# Altium schematic sheet 40_INPUT_ROUTING.SchDoc
size A; SheetNumber: 5; SheetTotal: 8
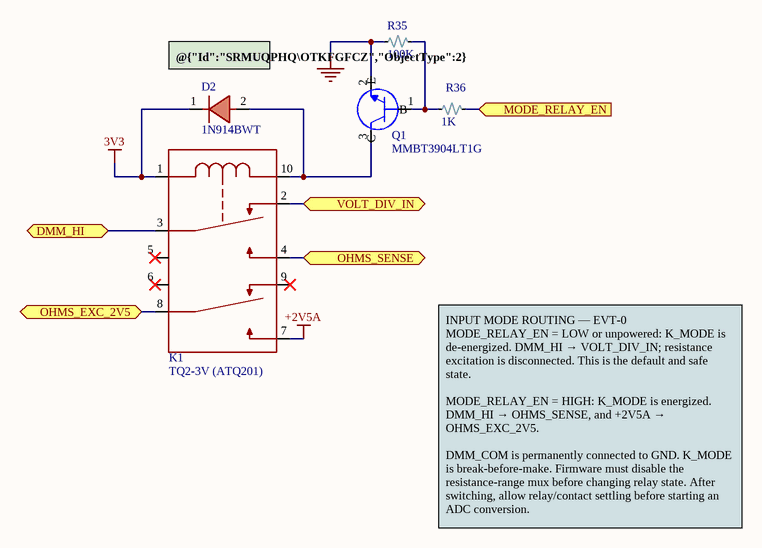
[diagram p0: 40_INPUT_ROUTING.SchDoc]

## Parts
D2  1N914BWT  [1N914BWT]
K1  TQ2-3V (ATQ201)  [TQ2-3V]
Q1  MMBT3904LT1G  [MMBT3904]
R35  100K  [R0805]
R36  1K  [R0805]

## Ports
DMM_HI (bidir, see 00_SYSTEM_TOP[4C], 70_MODULE_INTERFACE[1B]), MODE_RELAY_EN (in, see 00_SYSTEM_TOP[3B], 20_MCU_BLE[1C]), OHMS_EXC_2V5 (bidir, see 00_SYSTEM_TOP[4B], 60_RESISTANCE_FRONTEND[4B]), OHMS_SENSE (bidir, see 00_SYSTEM_TOP[3B], 60_RESISTANCE_FRONTEND[2B]), VOLT_DIV_IN (bidir, see 00_SYSTEM_TOP[3C], 50_VOLTAGE_FRONTEND[2B])

## Nets
3V3: D2.1(cathode) K1.1
+2V5A: K1.7
GND: Q1.2(E) R35.1
DMM_HI: K1.3 ; port DMM_HI
MODE_RELAY_EN: R36.2 ; port MODE_RELAY_EN
OHMS_EXC_2V5: K1.8 ; port OHMS_EXC_2V5
OHMS_SENSE: K1.4 ; port OHMS_SENSE
VOLT_DIV_IN: K1.2 ; port VOLT_DIV_IN
NetD2_2: D2.2(anode) K1.10 Q1.3(C)
NetQ1_1: Q1.1(B) R35.2 R36.1

Not connected (* = marked no-connect by the designer): K1 5* 6* 9*

## Notes on the sheet
- (near D2) @{"Id":"SRMUQPHQ\OTKFGFCZ","ObjectType":2} V/Ω Select
- INPUT MODE ROUTING — EVT-0
  MODE_RELAY_EN = LOW or unpowered: K_MODE is de-energized. DMM_HI → VOLT_DIV_IN; resistance excitation is disconnected. This is the default and safe state.
  MODE_RELAY_EN = HIGH: K_MODE is energized. DMM_HI → OHMS_SENSE, and +2V5A → OHMS_EXC_2V5.
  DMM_COM is permanently connected to GND. K_MODE is break-before-make. Firmware must disable the resistance-range mux before changing relay state. After switching, allow relay/contact settling before starting an ADC conversion.

## Library data of the parts
D2 = 1N914BWT: DIODE STANDARD 75V 200MA SOD523F; Manufacturer: onsemi; Manufacturer Lifecycle Status: ACTIVE; Value: 4pF; Element Configuration: Single; Forward Current: 300mA; Forward Voltage: 720mV; Max Junction Temperature (Tj): 150°C; Max Output current: 150mA; Max Power Dissipation: 200mW; Max Reverse Leakage Current: 5µA; Number of Elements: 1; Recovery Time: 4ns; Reverse Voltage: 100V; Supplier: DigiKey; Supplier Part Number: 1N914BWTCT-ND; Manufacturer Part Number: 1N914BWT; RoHS: Compliant; Category: Rectifier Diodes; Stock: 1541183; Pricing: 1=0.17, 10=0.102, 50=0.0726, 100=0.0629, 500=0.04556 (USD); Average Rectified Current: 200mA; China RoHS: Compliant; Contact Plating: Tin; Country of Origin: Mainland China; Export Control Classification Number (ECCN) Code: EAR99; Height: 700µm; Harmonized Tariff Schedule (HTS) Code: 8541.10.00.70; Introduction Date: 2008-03-18; Lead Free: Lead Free; Lifecycle Status: Production; Max Operating Temperature: 150°C; Max Repetitive Reverse Voltage (Vrrm): 75V; Max Reverse Voltage (DC): 75V; Min Operating Temperature: -55°C; Mounting Technology: Surface Mount; Pins: 2; Number of Terminals: 2; Peak Reverse Current: 5µA; Power Dissipation: 200mW; Radiation Hardening: No; REACH SVHC: Yes; Reverse Recovery Time: 4ns; Reverse Standoff Voltage: 75V; Schedule B: 8541100070, 8541100070|8541100070|8541100070|8541100070|8541100070; Weight: 10mg; ComponentLink1URL: https://datasheet.octopart.com:443/1N914BWT-ON-Semiconductor-datasheet-137236191.pdf?src-supplier=JRH+Electronics; ComponentLink1Description: https://datasheet.octopart.com:443/1N914BWT-ON-Semiconductor-datasheet-137236191.pdf?src-supplier=JRH+Electronics; ComponentLink2URL: https://sigma.octopart.com:443/138897313/technical_drawing/ON-Semiconductor-1N914BWT.pdf?src-supplier=Upverter; ComponentLink2Description: https://sigma.octopart.com:443/138897313/technical_drawing/ON-Semiconductor-1N914BWT.pdf?src-supplier=Upverter; ComponentLink3URL: https://datasheet.octopart.com:443/1N914BWT-ON-Semiconductor-datasheet-8641207.pdf?src-supplier=IHS; ComponentLink3Description: https://datasheet.octopart.com:443/1N914BWT-ON-Semiconductor-datasheet-8641207.pdf?src-supplier=IHS; ComponentLink4URL: https://datasheet.octopart.com:443/1N914BWT-onsemi-datasheet-181265884.pdf?src-supplier=IHS; ComponentLink4Description: https://datasheet.octopart.com:443/1N914BWT-onsemi-datasheet-181265884.pdf?src-supplier=IHS; ComponentLink5URL: https://datasheet.octopart.com:443/1N914BWT-ON-Semiconductor-datasheet-85393215.pdf?src-supplier=onsemi; ComponentLink5Description: https://datasheet.octopart.com:443/1N914BWT-ON-Semiconductor-datasheet-85393215.pdf?src-supplier=onsemi; ComponentLink6URL: https://datasheet.octopart.com:443/1N914BWT-ON-Semiconductor-datasheet-86684494.pdf?src-supplier=onsemi; ComponentLink6Description: https://datasheet.octopart.com:443/1N914BWT-ON-Semiconductor-datasheet-86684494.pdf?src-supplier=onsemi; ComponentLink7URL: https://datasheet.octopart.com:443/1N914BWT-ON-Semiconductor-datasheet-86681974.pdf?src-supplier=element14+APAC; ComponentLink7Description: https://datasheet.octopart.com:443/1N914BWT-ON-Semiconductor-datasheet-86681974.pdf?src-supplier=element14+APAC; ComponentLink8URL: https://datasheet.octopart.com:443/1N914BWT-Fairchild-datasheet-597795.pdf?src-supplier=Future+Electronics; ComponentLink8Description: https://datasheet.octopart.com:443/1N914BWT-Fairchild-datasheet-597795.pdf?src-supplier=Future+Electronics; ComponentLink9URL: https://sigma.octopart.com:443/17343427/technical_drawing/Fairchild-Semiconductor-1N914BWT.pdf?src-supplier=Fairchild+Semiconductor; ComponentLink9Description: https://sigma.octopart.com:443/17343427/technical_drawing/Fairchild-Semiconductor-1N914BWT.pdf?src-supplier=Fairchild+Semiconductor; ComponentLink10URL: https://datasheet.octopart.com:443/1N914BWT-Fairchild-Semiconductor-datasheet-67878665.pdf?src-supplier=Farnell; ComponentLink10Description: https://datasheet.octopart.com:443/1N914BWT-Fairchild-Semiconductor-datasheet-67878665.pdf?src-supplier=Farnell; ComponentLink11URL: https://datasheet.octopart.com:443/1N914BWT-Fairchild-Semiconductor-datasheet-68649996.pdf?src-supplier=Farnell; ComponentLink11Description: https://datasheet.octopart.com:443/1N914BWT-Fairchild-Semiconductor-datasheet-68649996.pdf?src-supplier=Farnell; ComponentLink12URL: https://datasheet.octopart.com:443/1N914BWT-Fairchild-Semiconductor-datasheet-78857206.pdf?src-supplier=Farnell; ComponentLink12Description: https://datasheet.octopart.com:443/1N914BWT-Fairchild-Semiconductor-datasheet-78857206.pdf?src-supplier=Farnell; ComponentLink13URL: https://datasheet.octopart.com:443/1N914BWT-Fairchild-Semiconductor-datasheet-67909706.pdf?src-supplier=Newark; ComponentLink13Description: https://datasheet.octopart.com:443/1N914BWT-Fairchild-Semiconductor-datasheet-67909706.pdf?src-supplier=Newark; ComponentLink14URL: https://datasheet.octopart.com:443/1N914BWT-Fairchild-Semiconductor-datasheet-68364971.pdf?src-supplier=Newark; ComponentLink14Description: https://datasheet.octopart.com:443/1N914BWT-Fairchild-Semiconductor-datasheet-68364971.pdf?src-supplier=Newark; ComponentLink15URL: https://datasheet.octopart.com:443/1N914BWT-Fairchild-Semiconductor-datasheet-71421042.pdf?src-supplier=Newark; ComponentLink15Description: https://datasheet.octopart.com:443/1N914BWT-Fairchild-Semiconductor-datasheet-71421042.pdf?src-supplier=Newark; ComponentLink16URL: http://sigma.octopart.com:80/150599636/rohs_statement/ON-Semiconductor-1N914BWT.pdf?src-supplier=Compliance+Statements; ComponentLink16Description: http://sigma.octopart.com:80/150599636/rohs_statement/ON-Semiconductor-1N914BWT.pdf?src-supplier=Compliance+Statements; ComponentLink17URL: http://sigma.octopart.com:80/17343722/reach_statement/Fairchild-Semiconductor-1N914BWT.pdf?src-supplier=Compliance+Statements; ComponentLink17Description: http://sigma.octopart.com:80/17343722/reach_statement/Fairchild-Semiconductor-1N914BWT.pdf?src-supplier=Compliance+Statements; ComponentLink18URL: http://sigma.octopart.com:80/17343723/materials_sheet/Fairchild-Semiconductor-1N914BWT.pdf?src-supplier=Compliance+Statements; ComponentLink18Description: http://sigma.octopart.com:80/17343723/materials_sheet/Fairchild-Semiconductor-1N914BWT.pdf?src-supplier=Compliance+Statements; ComponentLink19URL: http://sigma.octopart.com:80/33033631/reach_statement/Fairchild-Semiconductor-1N914BWT.pdf?src-supplier=Compliance+Statements; ComponentLink19Description: http://sigma.octopart.com:80/33033631/reach_statement/Fairchild-Semiconductor-1N914BWT.pdf?src-supplier=Compliance+Statements; ComponentLink20URL: http://sigma.octopart.com:80/33033633/materials_sheet/Fairchild-Semiconductor-1N914BWT.pdf?src-supplier=Compliance+Statements; ComponentLink20Description: http://sigma.octopart.com:80/33033633/materials_sheet/Fairchild-Semiconductor-1N914BWT.pdf?src-supplier=Compliance+Statements; ComponentLink21URL: http://sigma.octopart.com:80/reach_statement/ON-Semiconductor-company-79.pdf?src-supplier=Compliance+Statements; ComponentLink21Description: http://sigma.octopart.com:80/reach_statement/ON-Semiconductor-company-79.pdf?src-supplier=Compliance+Statements; ComponentLink22URL: http://sigma.octopart.com:80/rohs_statement/Fairchild-Semiconductor-company-11.pdf?src-supplier=Compliance+Statements; ComponentLink22Description: http://sigma.octopart.com:80/rohs_statement/Fairchild-Semiconductor-company-11.pdf?src-supplier=Compliance+Statements; ComponentLink23URL: http://sigma.octopart.com:80/rohs_statement/Fairchild-Semiconductor-company-10.pdf?src-supplier=Compliance+Statements; ComponentLink23Description: http://sigma.octopart.com:80/rohs_statement/Fairchild-Semiconductor-company-10.pdf?src-supplier=Compliance+Statements; ComponentLink24URL: http://sigma.octopart.com:80/reach_statement/Fairchild-Semiconductor-company-9.pdf?src-supplier=Compliance+Statements; ComponentLink24Description: http://sigma.octopart.com:80/reach_statement/Fairchild-Semiconductor-company-9.pdf?src-supplier=Compliance+Statements; ComponentLink25URL: https://octopart.com:443/opatz8j6/c1?t=AH9zcMxkeAdW6q2Eq6b7IE3o8p7oJyfCCWP2LD7p9dkg8_1XgT_uIYUIfv7lhcHO3Lm2dWJ0vyWcCXTmI-m6i_e3bz1ygKnSbTknupXSFzBNj_HpxZskJCgN2zBylGov1HFklhlqrpHlO6K5AZ62MDKnKfmeey-sKx5zLLXPz3vdpqjCapaf97_w5ymRJ4vykqn37E9iqiVHqZfTnoawsGL7kQ2_tC5XJG82m9dj8CjUa7IyLd46aJZw47PNoUwIy-tktB34mxPYkgoIYMPq_y-2_Zl7oOQxNhckIE8NgxTfVSFSWYFJhemMnrsZ4FmlJAaE9JBv7LsFpjF61P3RKffqM8U7tIBEs0IC&src-supplier=Compliance+Statements; ComponentLink25Description: https://octopart.com:443/opatz8j6/c1?t=AH9zcMxkeAdW6q2Eq6b7IE3o8p7oJyfCCWP2LD7p9dkg8_1XgT_uIYUIfv7lhcHO3Lm2dWJ0vyWcCXTmI-m6i_e3bz1ygKnSbTknupXSFzBNj_HpxZskJCgN2zBylGov1HFklhlqrpHlO6K5AZ62MDKnKfmeey-sKx5zLLXPz3vdpqjCapaf97_w5ymRJ4vykqn37E9iqiVHqZfTnoawsGL7kQ2_tC5XJG82m9dj8CjUa7IyLd46aJZw47PNoUwIy-tktB34mxPYkgoIYMPq_y-2_Zl7oOQxNhckIE8NgxTfVSFSWYFJhemMnrsZ4FmlJAaE9JBv7LsFpjF61P3RKffqM8U7tIBEs0IC&src-supplier=Compliance+Statements; ComponentLink26URL: https://octopart.com:443/opatz8j6/c1?t=xkFbza4jrI2CRbegTQyc3OoFkt0wJLseTZvNZoS9ZK7og4IYeJkRm8Wtlicq30gKrCmXKYAvwhfUWUd8QrgiWtGr-1lPch9YM6_eRKvxcMBeJPMVF6fuXrX8qVzrjdJE_ba4nBK8Av8ejJiUOIqoCK4JwxbrI670KPmrS7lZhK3d4M9ClcgV1EdcA89oUfKfxSXdDQ7ptMPVQyO9dYqcVLlwZjgXP6pJFSDaJyXdYctBiNO3pJoYg6YNiGqR74o654sFLuxF_heBqsxkg6UEULjNDBDBmm8bGtxjuaEt4DFGZZVVzAgQnbURpSvQrJSnNWgco6nydRWV0EfJMGefeNg22mY4HSjyeBXs9g&src-supplier=Compliance+Statements; ComponentLink26Description: https://octopart.com:443/opatz8j6/c1?t=xkFbza4jrI2CRbegTQyc3OoFkt0wJLseTZvNZoS9ZK7og4IYeJkRm8Wtlicq30gKrCmXKYAvwhfUWUd8QrgiWtGr-1lPch9YM6_eRKvxcMBeJPMVF6fuXrX8qVzrjdJE_ba4nBK8Av8ejJiUOIqoCK4JwxbrI670KPmrS7lZhK3d4M9ClcgV1EdcA89oUfKfxSXdDQ7ptMPVQyO9dYqcVLlwZjgXP6pJFSDaJyXdYctBiNO3pJoYg6YNiGqR74o654sFLuxF_heBqsxkg6UEULjNDBDBmm8bGtxjuaEt4DFGZZVVzAgQnbURpSvQrJSnNWgco6nydRWV0EfJMGefeNg22mY4HSjyeBXs9g&src-supplier=Compliance+Statements
K1 = TQ2-3V: Electromechanical Relay Double Pole Double Throw 1A 3 Volt 64.3Ohm Through Hole; Manufacturer: Panasonic; Manufacturer Lifecycle Status: ACTIVE; Coil Current: 47mA; Coil Power: 140mW; Coil Resistance: 64.3Ω; Coil Type: Non-Latching; Coil Voltage (DC): 2.25V; Contact Resistance: 50Ω; Contact Voltage Rating (AC): 125V; Electrical Life: 200kcycles; Insertion Loss (dB): 0.6dB; Max Voltage Rating (DC): 110V; Number of Contacts: 2; Operate Time: 3ms; Power Dissipation: 140W; Ratings: CSA; Relay Type: Telecom; Throw Configuration: DPDT; Supplier: DigiKey; Supplier Part Number: 255-1225-5-ND; Manufacturer Part Number: TQ2-3V; RoHS: Compliant; Category: Signal Relays; Stock: 2058; Pricing: 1=2.36, 10=2.103, 25=2.0084, 50=1.9398, 100=1.8734, 250=1.78892, 500=1.72756, 1000=1.66825, 5000=1.53812 (USD); Case/Package: DIP; Contact Current Rating: 1A; Contact Material: Gold, Silver; Contact Plating: Gold, Silver; Current Rating: 1A; Depth: 9mm; Height: 5mm; Lead Free: Lead Free; Length: 14mm; Lifecycle Status: Production; Max Current Rating: 1A; Max Operating Temperature: 70°C; Max Voltage Rating (AC): 125V; Min Operating Temperature: -40°C; Mounting Technology: Through Hole; Pins: 8; Packaging: Bulk; Power Consumption: 140mW; Radiation Hardening: No; REACH SVHC: Yes; Release Time: 3ms; Response Time: 3ms; Switching Current: 1A; Termination: Solder; Type: Electromechanical; Voltage Rating (AC): 125V; Voltage Rating (DC): 110V; Weight: 1.5g; Width: 9mm; ComponentLink1URL: https://datasheet.octopart.com:443/TQ2-3V-Panasonic-datasheet-8361856.pdf?src-supplier=Panasonic; ComponentLink1Description: https://datasheet.octopart.com:443/TQ2-3V-Panasonic-datasheet-8361856.pdf?src-supplier=Panasonic; ComponentLink2URL: https://datasheet.octopart.com:443/TQ2-3V-Panasonic-datasheet-11522959.pdf?src-supplier=Panasonic; ComponentLink2Description: https://datasheet.octopart.com:443/TQ2-3V-Panasonic-datasheet-11522959.pdf?src-supplier=Panasonic; ComponentLink3URL: https://datasheet.octopart.com:443/TQ2-3V-Panasonic-datasheet-34148902.pdf?src-supplier=IHS; ComponentLink3Description: https://datasheet.octopart.com:443/TQ2-3V-Panasonic-datasheet-34148902.pdf?src-supplier=IHS; ComponentLink4URL: https://datasheet.octopart.com:443/TQ2-3V-Panasonic-datasheet-109883.pdf?src-supplier=element14; ComponentLink4Description: https://datasheet.octopart.com:443/TQ2-3V-Panasonic-datasheet-109883.pdf?src-supplier=element14; ComponentLink5URL: https://datasheet.octopart.com:443/TQ2-3V-Panasonic-datasheet-16066.pdf?src-supplier=element14; ComponentLink5Description: https://datasheet.octopart.com:443/TQ2-3V-Panasonic-datasheet-16066.pdf?src-supplier=element14; ComponentLink6URL: https://datasheet.octopart.com:443/TQ2-3V-Panasonic-datasheet-12570800.pdf?src-supplier=Farnell; ComponentLink6Description: https://datasheet.octopart.com:443/TQ2-3V-Panasonic-datasheet-12570800.pdf?src-supplier=Farnell; ComponentLink7URL: https://datasheet.octopart.com:443/TQ2-3V-Panasonic-datasheet-136735749.pdf?src-supplier=Electro+Sonic; ComponentLink7Description: https://datasheet.octopart.com:443/TQ2-3V-Panasonic-datasheet-136735749.pdf?src-supplier=Electro+Sonic; ComponentLink8URL: https://datasheet.octopart.com:443/TQ2-3V-Panasonic-datasheet-27895613.pdf?src-supplier=Electro+Sonic; ComponentLink8Description: https://datasheet.octopart.com:443/TQ2-3V-Panasonic-datasheet-27895613.pdf?src-supplier=Electro+Sonic; ComponentLink9URL: https://datasheet.octopart.com:443/TQ2-3V-Panasonic-EW-datasheet-23711783.pdf?src-supplier=Electro+Sonic; ComponentLink9Description: https://datasheet.octopart.com:443/TQ2-3V-Panasonic-EW-datasheet-23711783.pdf?src-supplier=Electro+Sonic; ComponentLink10URL: https://datasheet.octopart.com:443/TQ2-3V-Panasonic-datasheet-164871806.pdf?src-supplier=Burklin+Elektronik; ComponentLink10Description: https://datasheet.octopart.com:443/TQ2-3V-Panasonic-datasheet-164871806.pdf?src-supplier=Burklin+Elektronik; ComponentLink11URL: https://datasheet.octopart.com:443/TQ2-3V-Panasonic-datasheet-152536022.pdf?src-supplier=Master+Electronics; ComponentLink11Description: https://datasheet.octopart.com:443/TQ2-3V-Panasonic-datasheet-152536022.pdf?src-supplier=Master+Electronics; ComponentLink12URL: https://datasheet.octopart.com:443/TQ2-3V-Panasonic-datasheet-138897391.pdf?src-supplier=Sager+Electronics; ComponentLink12Description: https://datasheet.octopart.com:443/TQ2-3V-Panasonic-datasheet-138897391.pdf?src-supplier=Sager+Electronics; ComponentLink13URL: https://datasheet.octopart.com:443/TQ2-3V-Panasonic-datasheet-13694242.pdf?src-supplier=_legacy+Avnet; ComponentLink13Description: https://datasheet.octopart.com:443/TQ2-3V-Panasonic-datasheet-13694242.pdf?src-supplier=_legacy+Avnet; ComponentLink14URL: https://datasheet.octopart.com:443/TQ2-3V-Panasonic-datasheet-7279417.pdf?src-supplier=Jameco+(USA); ComponentLink14Description: https://datasheet.octopart.com:443/TQ2-3V-Panasonic-datasheet-7279417.pdf?src-supplier=Jameco+(USA); Supplier 1: Future Electronics; Supplier Part Number 1: TQ2-3V
Q1 = MMBT3904LT1G: TRANS NPN 40V 0.2A SOT23-3; Manufacturer: onsemi; Manufacturer Lifecycle Status: ACTIVE; Collector Base Voltage (VCBO): 60V; Collector Emitter Saturation Voltage: 200mV; Current Rating: 200mA; Element Configuration: Single; Emitter Base Voltage (VEBO): 6V; Frequency: 300MHz; hFE Min: 30; Max Junction Temperature (Tj): 150°C; Max Power Dissipation: 300mW; Number of Elements: 1; Power Dissipation: 225mW; Type: General Purpose; Supplier: DigiKey; Supplier Part Number: MMBT3904LT1GOSDKR-ND; Manufacturer Part Number: MMBT3904LT1G; RoHS: Compliant; Category: BJTs; Stock: 189758; Pricing: 1=0.14, 10=0.086, 100=0.0527, 500=0.03806, 1000=0.03329 (USD); Case/Package: SOT-23; China RoHS: Compliant; Collector Emitter Breakdown Voltage: 40V; Collector Emitter Voltage (VCEO): 40V; Contact Plating: Tin; Gain Bandwidth Product: 300MHz; Height: 1.11mm; Lead Free: Lead Free; Length: 2.9mm; Lifecycle Status: Production; Max Breakdown Voltage: 40V; Max Collector Current: 200mA; Clock Frequency: 300MHz; Max Operating Temperature: 150°C; Min Operating Temperature: -55°C; Pins: 3; Number of Terminals: 3; Packaging: Tape and Reel; Polarity: NPN; Radiation Hardening: No; REACH SVHC: Yes; Schedule B: 8541210080; Transition Frequency: 300MHz; Voltage Rating (DC): 40V; Width: 1.3mm; ComponentLink1URL: https://datasheet.octopart.com:443/MMBT3904LT1G-ON-Semiconductor-datasheet-11971584.pdf?src-supplier=Upverter; ComponentLink1Description: https://datasheet.octopart.com:443/MMBT3904LT1G-ON-Semiconductor-datasheet-11971584.pdf?src-supplier=Upverter; ComponentLink2URL: https://datasheet.octopart.com:443/MMBT3904LT1G-ON-Semiconductor-datasheet-618661.pdf?src-supplier=Upverter; ComponentLink2Description: https://datasheet.octopart.com:443/MMBT3904LT1G-ON-Semiconductor-datasheet-618661.pdf?src-supplier=Upverter; ComponentLink3URL: https://datasheet.octopart.com:443/MMBT3904LT1G-ON-Semiconductor-datasheet-8327178.pdf?src-supplier=Upverter; ComponentLink3Description: https://datasheet.octopart.com:443/MMBT3904LT1G-ON-Semiconductor-datasheet-8327178.pdf?src-supplier=Upverter; ComponentLink4URL: https://sigma.octopart.com:443/138897241/technical_drawing/ON-Semiconductor-MMBT3904LT1G.pdf?src-supplier=Upverter; ComponentLink4Description: https://sigma.octopart.com:443/138897241/technical_drawing/ON-Semiconductor-MMBT3904LT1G.pdf?src-supplier=Upverter; ComponentLink5URL: https://datasheet.octopart.com:443/MMBT3904LT1G-ON-Semiconductor-datasheet-94100684.pdf?src-supplier=Newark; ComponentLink5Description: https://datasheet.octopart.com:443/MMBT3904LT1G-ON-Semiconductor-datasheet-94100684.pdf?src-supplier=Newark; ComponentLink6URL: https://datasheet.octopart.com:443/MMBT3904LT1G-onsemi-datasheet-175423507.pdf?src-supplier=IHS; ComponentLink6Description: https://datasheet.octopart.com:443/MMBT3904LT1G-onsemi-datasheet-175423507.pdf?src-supplier=IHS; ComponentLink7URL: https://datasheet.octopart.com:443/MMBT3904LT1G-ON-Semiconductor-datasheet-15850735.pdf?src-supplier=element14+APAC; ComponentLink7Description: https://datasheet.octopart.com:443/MMBT3904LT1G-ON-Semiconductor-datasheet-15850735.pdf?src-supplier=element14+APAC; ComponentLink8URL: https://datasheet.octopart.com:443/MMBT3904LT1G-onsemi-datasheet-157205106.pdf?src-supplier=TME; ComponentLink8Description: https://datasheet.octopart.com:443/MMBT3904LT1G-onsemi-datasheet-157205106.pdf?src-supplier=TME; ComponentLink9URL: https://datasheet.octopart.com:443/MMBT3904LT1G-ON-Semiconductor-datasheet-42916338.pdf?src-supplier=Seeed+Studio; ComponentLink9Description: https://datasheet.octopart.com:443/MMBT3904LT1G-ON-Semiconductor-datasheet-42916338.pdf?src-supplier=Seeed+Studio; ComponentLink10URL: https://datasheet.octopart.com:443/MMBT3904LT1G-ON-Semiconductor-datasheet-14065146.pdf?src-supplier=iiiC; ComponentLink10Description: https://datasheet.octopart.com:443/MMBT3904LT1G-ON-Semiconductor-datasheet-14065146.pdf?src-supplier=iiiC; ComponentLink11URL: https://datasheet.octopart.com:443/MMBT3904LT1G-onsemi-datasheet-11078203.pdf?src-supplier=Master+Electronics; ComponentLink11Description: https://datasheet.octopart.com:443/MMBT3904LT1G-onsemi-datasheet-11078203.pdf?src-supplier=Master+Electronics; ComponentLink12URL: https://datasheet.octopart.com:443/MMBT3904LT1G-ON-Semiconductor-datasheet-9992889.pdf?src-supplier=RS+(Formerly+Allied+Electronics); ComponentLink12Description: https://datasheet.octopart.com:443/MMBT3904LT1G-ON-Semiconductor-datasheet-9992889.pdf?src-supplier=RS+(Formerly+Allied+Electronics); ComponentLink13URL: http://sigma.octopart.com:80/150618431/rohs_statement/ON-Semiconductor-MMBT3904LT1G.pdf?src-supplier=Compliance+Statements; ComponentLink13Description: http://sigma.octopart.com:80/150618431/rohs_statement/ON-Semiconductor-MMBT3904LT1G.pdf?src-supplier=Compliance+Statements; ComponentLink14URL: http://sigma.octopart.com:80/reach_statement/ON-Semiconductor-company-79.pdf?src-supplier=Compliance+Statements; ComponentLink14Description: http://sigma.octopart.com:80/reach_statement/ON-Semiconductor-company-79.pdf?src-supplier=Compliance+Statements; ComponentLink15URL: http://sigma.octopart.com:80/rohs_statement/Fairchild-Semiconductor-company-11.pdf?src-supplier=Compliance+Statements; ComponentLink15Description: http://sigma.octopart.com:80/rohs_statement/Fairchild-Semiconductor-company-11.pdf?src-supplier=Compliance+Statements; ComponentLink16URL: http://sigma.octopart.com:80/rohs_statement/Fairchild-Semiconductor-company-10.pdf?src-supplier=Compliance+Statements; ComponentLink16Description: http://sigma.octopart.com:80/rohs_statement/Fairchild-Semiconductor-company-10.pdf?src-supplier=Compliance+Statements; ComponentLink17URL: http://sigma.octopart.com:80/reach_statement/Fairchild-Semiconductor-company-9.pdf?src-supplier=Compliance+Statements; ComponentLink17Description: http://sigma.octopart.com:80/reach_statement/Fairchild-Semiconductor-company-9.pdf?src-supplier=Compliance+Statements; ComponentLink18URL: https://octopart.com:443/opatz8j6/c1?t=6Xn7ZrF6hysOUC84qlrSqY4wiQdrN-mPXKQ_8Rla8IkVly0DBC3XMOxgBnPoFxbPxSduxt1CU9xvbCNH0dZZ2fSPxrCiu0NHjXK1AEqfl5xODuP5YJP7pfSgZ8QNFl02tAnTqW6w1aVJmMTvNdbX5LfPzPLhtU1PYqNVsEPH2I4uNn2UF3IV2P2UT1zVRcnQIPoIWXKohBgaCPKWifMJG2N61Au2Wz4170xn6Vu5FG_CLPs0I4wu6gksT39gSmG6GKW27rzSZjefFxUNhsDMvXXdZPXoa_giO80NkyKEb8_6ha9AliWeLbEvMGgfnng9nYF8sw6XCX6uqkfeLxUIFVSSx4aXaZZhz9egcw&src-supplier=Compliance+Statements; ComponentLink18Description: https://octopart.com:443/opatz8j6/c1?t=6Xn7ZrF6hysOUC84qlrSqY4wiQdrN-mPXKQ_8Rla8IkVly0DBC3XMOxgBnPoFxbPxSduxt1CU9xvbCNH0dZZ2fSPxrCiu0NHjXK1AEqfl5xODuP5YJP7pfSgZ8QNFl02tAnTqW6w1aVJmMTvNdbX5LfPzPLhtU1PYqNVsEPH2I4uNn2UF3IV2P2UT1zVRcnQIPoIWXKohBgaCPKWifMJG2N61Au2Wz4170xn6Vu5FG_CLPs0I4wu6gksT39gSmG6GKW27rzSZjefFxUNhsDMvXXdZPXoa_giO80NkyKEb8_6ha9AliWeLbEvMGgfnng9nYF8sw6XCX6uqkfeLxUIFVSSx4aXaZZhz9egcw&src-supplier=Compliance+Statements; ComponentLink19URL: https://octopart.com:443/opatz8j6/c1?t=8IRzLcMOYTb9JijI-po6TFZCAUzXib-H1R20XCLpzmhIGre0bWRXe4ZO8lRdDfF3CLOGncXrdohN3KmiOTqxwjTHC1r89hWIZDbBVEUVc9Q9O159qKwDTUXpIzAsHJigIaeBGLyIo10FCT0IJpWkJe3Af8Ts36u8FHUZlIMCnry_JzPNglOFJd8Q37gYK_hPK5FL94xWLlsZYNj58V_g4S0R_SZTueiY5oHGNdfq_Zs3fbV3kHE__W-q6emv4yhSM8EHIIJwaXdr2iL-5-sB4yTOqwO_ItA84y4jC2VE_619edN7Ju53SNxRGHixzhXtKIq-sYkPqUptt85PTjBtSIydYnRzf0D6rRR5&src-supplier=Compliance+Statements; ComponentLink19Description: https://octopart.com:443/opatz8j6/c1?t=8IRzLcMOYTb9JijI-po6TFZCAUzXib-H1R20XCLpzmhIGre0bWRXe4ZO8lRdDfF3CLOGncXrdohN3KmiOTqxwjTHC1r89hWIZDbBVEUVc9Q9O159qKwDTUXpIzAsHJigIaeBGLyIo10FCT0IJpWkJe3Af8Ts36u8FHUZlIMCnry_JzPNglOFJd8Q37gYK_hPK5FL94xWLlsZYNj58V_g4S0R_SZTueiY5oHGNdfq_Zs3fbV3kHE__W-q6emv4yhSM8EHIIJwaXdr2iL-5-sB4yTOqwO_ItA84y4jC2VE_619edN7Ju53SNxRGHixzhXtKIq-sYkPqUptt85PTjBtSIydYnRzf0D6rRR5&src-supplier=Compliance+Statements
R35 R36 = R_0805: RES 1/8W 0805; Manufacturer: Stackpole Electronics; Manufacturer Part Number: RNCF0805TKY10K0; Manufacturer Package Identifier: 0805 (2012 metric); Max Power Dissipation: 125mW; Value: 10kΩ; Temperature Coefficient: 5ppm/°C; Tolerance: 0.01%; Working Voltage: 150V; Supplier: DigiKey; Supplier Part Number: RNCF0805TKY10K0CT-ND; RoHS: Compliant; Category: Chip SMD Resistors; Stock: 4649; Pricing: 1=1.61, 10=1.334, 50=1.1716, 100=1.1105, 500=0.99044, 1000=0.94751, 2000=0.90945, 3000=0.8893, 5000=0.86599, 7000=0.85183, 10000=0.8378 (USD); Case/Package: 0805; Case Code (Imperial): 0805; Case Code (Metric): 2012; Composition: Thin Film; Country of Origin: Taiwan; Export Control Classification Number (ECCN) Code: EAR99; Features: Moisture Resistant; Height: 550µm; Harmonized Tariff Schedule (HTS) Code: 8533.21.00.30; Introduction Date: 2011-06-03; Lead Free: Lead Free; Length: 2mm; Lifecycle Status: Production; Max Operating Temperature: 155°C; Min Operating Temperature: -55°C; Mounting Technology: Surface Mount; Number of Terminals: 2; Number of Terminations: 2; Packaging: Tape & Reel (TR); Power Rating: 125mW; Ratings: AEC-Q200; REACH SVHC: Yes; Schedule B: 8533210045, 8533210045|8533210045|8533210045|8533210045|8533210045; Width: 1.25mm; ComponentLink1URL: https://datasheet.octopart.com:443/RNCF0805TKY10K0-Stackpole-Electronics-datasheet-182148124.pdf?src-supplier=IHS; ComponentLink1Description: https://datasheet.octopart.com:443/RNCF0805TKY10K0-Stackpole-Electronics-datasheet-182148124.pdf?src-supplier=IHS; ComponentLink2URL: https://datasheet.octopart.com:443/RNCF0805TKY10K0-Stackpole-Electronics-datasheet-12511394.pdf?src-supplier=Factory+Futures; ComponentLink2Description: https://datasheet.octopart.com:443/RNCF0805TKY10K0-Stackpole-Electronics-datasheet-12511394.pdf?src-supplier=Factory+Futures; ComponentLink3URL: https://datasheet.octopart.com:443/RNCF0805TKY10K0-Stackpole-Electronics-datasheet-141158876.pdf?src-supplier=Stackpole+Electronics; ComponentLink3Description: https://datasheet.octopart.com:443/RNCF0805TKY10K0-Stackpole-Electronics-datasheet-141158876.pdf?src-supplier=Stackpole+Electronics; ComponentLink4URL: https://datasheet.octopart.com:443/RNCF0805TKY10K0-Stackpole-Electronics-datasheet-28504821.pdf?src-supplier=Master+Electronics; ComponentLink4Description: https://datasheet.octopart.com:443/RNCF0805TKY10K0-Stackpole-Electronics-datasheet-28504821.pdf?src-supplier=Master+Electronics; ComponentLink5URL: https://datasheet.octopart.com/RNCF0805TKY10K0-Stackpole-Electronics-datasheet-11755897.pdf; ComponentLink5Description: https://datasheet.octopart.com/RNCF0805TKY10K0-Stackpole-Electronics-datasheet-11755897.pdf; ComponentLink6URL: http://sigma.octopart.com:80/15941409/materials_sheet/Stackpole-Electronics-RNCF0805TKY10K0.pdf?src-supplier=Compliance+Statements; ComponentLink6Description: http://sigma.octopart.com:80/15941409/materials_sheet/Stackpole-Electronics-RNCF0805TKY10K0.pdf?src-supplier=Compliance+Statements; ComponentLink7URL: http://sigma.octopart.com:80/141158212/rohs_statement/Stackpole-Electronics-RNCF0805TKY10K0.pdf?src-supplier=Compliance+Statements; ComponentLink7Description: http://sigma.octopart.com:80/141158212/rohs_statement/Stackpole-Electronics-RNCF0805TKY10K0.pdf?src-supplier=Compliance+Statements; ComponentLink8URL: http://sigma.octopart.com:80/141158211/reach_statement/Stackpole-Electronics-RNCF0805TKY10K0.pdf?src-supplier=Compliance+Statements; ComponentLink8Description: http://sigma.octopart.com:80/141158211/reach_statement/Stackpole-Electronics-RNCF0805TKY10K0.pdf?src-supplier=Compliance+Statements